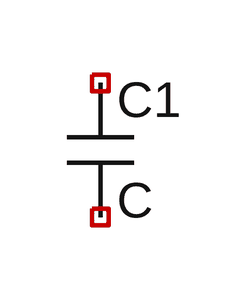
[diagram p0: schematic Miks spice.asc]
Miks spice.asc, the LTspice schematic file:
Version 4
SHEET 1 880 680
SYMBOL cap 48 144 R0
SYMATTR InstName C1

The netlist it stands for:
* Miks spice.asc
C1 NC_01 NC_02 C
.backanno
.end